# EAGLE design Nusbio 2-FT232BreakOut (EAGLE 7.5.0)
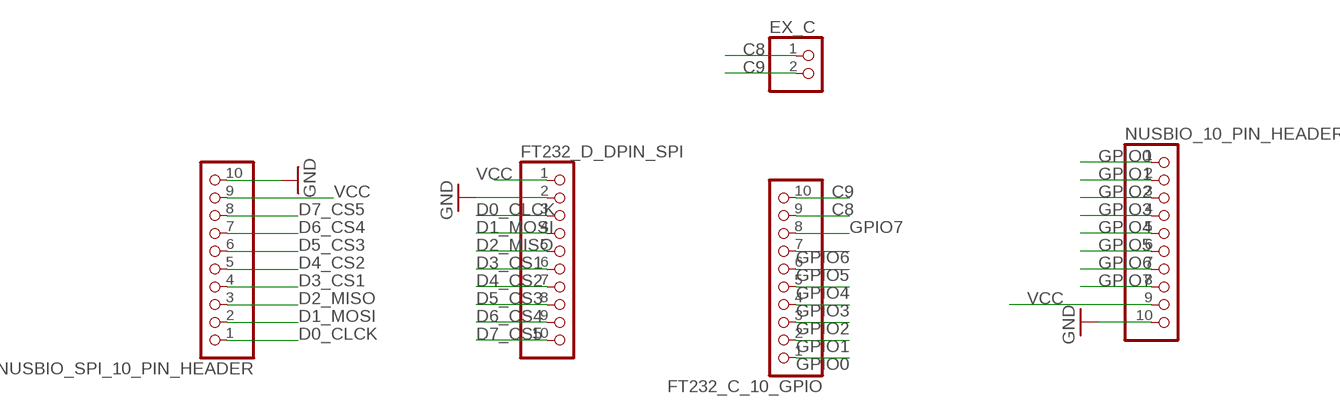
[diagram p0: schematic, sheet 1]

## Parts
EX_C  PINHD-1X2  [1X02]
FT232_C_10_GPIO  PINHD-1X10  [1X10]
FT232_D_DPIN_SPI  PINHD-1X10  [1X10]
NUSBIO_10_PIN_HEADER  PINHD-1X10  [1X10]
NUSBIO_SPI_10_PIN_HEADER  PINHD-1X10  [1X10]

## Nets
C8: EX_C.1 FT232_C_10_GPIO.9
C9: EX_C.2 FT232_C_10_GPIO.10
D0_CLCK: FT232_D_DPIN_SPI.3 NUSBIO_SPI_10_PIN_HEADER.1
D1_MOSI: FT232_D_DPIN_SPI.4 NUSBIO_SPI_10_PIN_HEADER.2
D2_MISO: FT232_D_DPIN_SPI.5 NUSBIO_SPI_10_PIN_HEADER.3
D3_CS1: FT232_D_DPIN_SPI.6 NUSBIO_SPI_10_PIN_HEADER.4
D4_CS2: FT232_D_DPIN_SPI.7 NUSBIO_SPI_10_PIN_HEADER.5
D5_CS3: FT232_D_DPIN_SPI.8 NUSBIO_SPI_10_PIN_HEADER.6
D6_CS4: FT232_D_DPIN_SPI.9 NUSBIO_SPI_10_PIN_HEADER.7
D7_CS5: FT232_D_DPIN_SPI.10 NUSBIO_SPI_10_PIN_HEADER.8
GND: FT232_D_DPIN_SPI.2 NUSBIO_10_PIN_HEADER.10 NUSBIO_SPI_10_PIN_HEADER.10
GPIO0: FT232_C_10_GPIO.1 NUSBIO_10_PIN_HEADER.1
GPIO1: FT232_C_10_GPIO.2 NUSBIO_10_PIN_HEADER.2
GPIO2: FT232_C_10_GPIO.3 NUSBIO_10_PIN_HEADER.3
GPIO3: FT232_C_10_GPIO.4 NUSBIO_10_PIN_HEADER.4
GPIO4: FT232_C_10_GPIO.5 NUSBIO_10_PIN_HEADER.5
GPIO5: FT232_C_10_GPIO.6 NUSBIO_10_PIN_HEADER.6
GPIO6: FT232_C_10_GPIO.7 NUSBIO_10_PIN_HEADER.7
GPIO7: FT232_C_10_GPIO.8 NUSBIO_10_PIN_HEADER.8
VCC: FT232_D_DPIN_SPI.1 NUSBIO_10_PIN_HEADER.9 NUSBIO_SPI_10_PIN_HEADER.9

## Library data of the parts
EX_C = pinhead:PINHD-1X2: PIN HEADER
FT232_C_10_GPIO FT232_D_DPIN_SPI NUSBIO_10_PIN_HEADER NUSBIO_SPI_10_PIN_HEADER = pinhead:PINHD-1X10: PIN HEADER

## Board
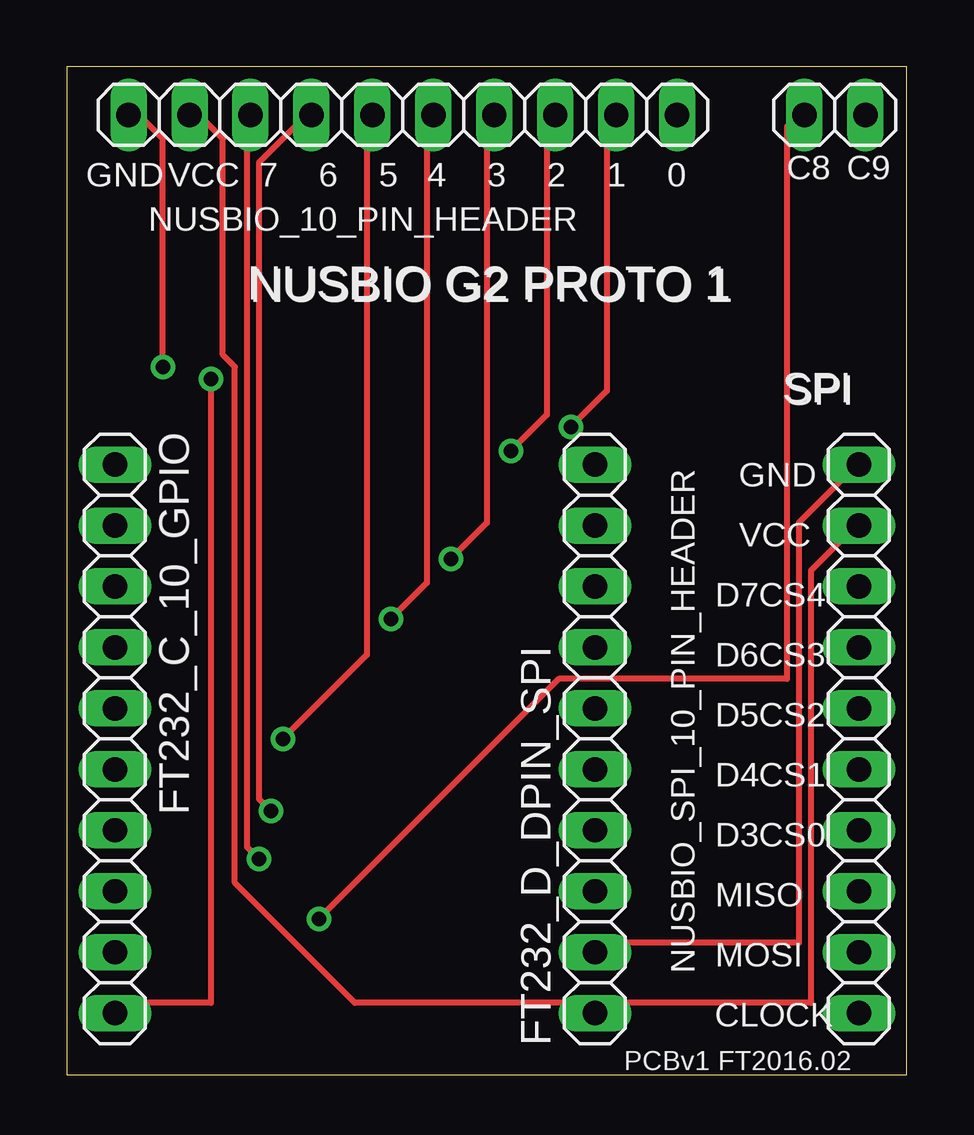
[diagram p1: board, top side]
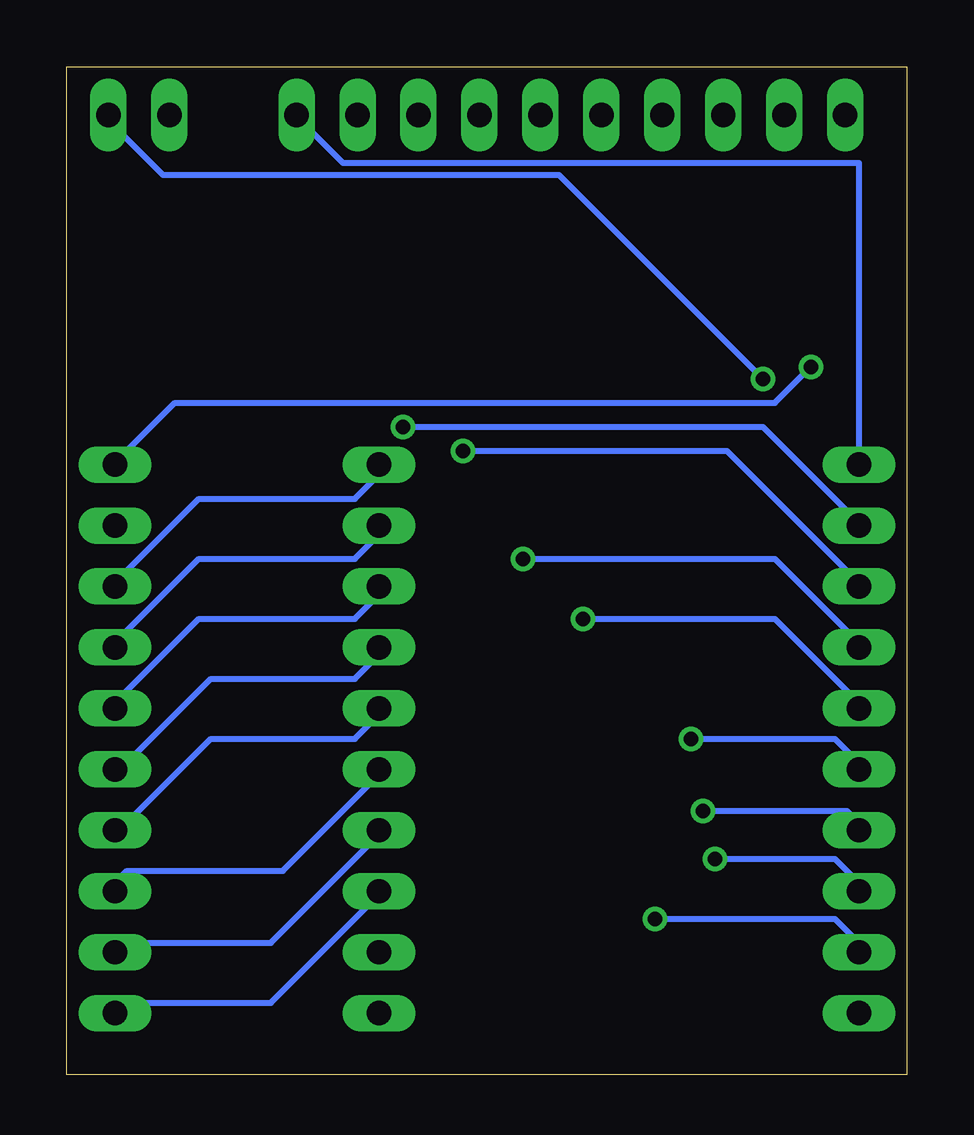
[diagram p2: board, bottom side, seen from below]

Size 35 x 42 mm. Coordinates in mm from the lower left corner, seen from the top.
Outline: 0,0 35,0 35,42 0,42 0,0
Copper layers (1*16): Top 0.035mm / dielectric 1.5mm / Bottom 0.035mm
Design rules "default": minimum track width 10mil, minimum drill 24mil, track to track 8mil, track to pad 8mil, pad to pad 8mil, via to via 8mil, smd to smd 8mil, copper to edge 40mil, drill to drill 8mil, minimum pad ring 10mil, minimum via ring 8mil, stop-mask expansion 4mil, vias tented up to drill 0mil, thermal gap 10mil

### Footprints (pad centres in the part's own frame; a part is rotated, then mirrored left to right if it is on the bottom)
1X02 = drill 1.016 long: 1 -1.27,0; 2 1.27,0
1X10 = drill 1.016 long: 1 -11.43,0; 2 -8.89,0; 3 -6.35,0; 4 -3.81,0; 5 -1.27,0; 6 1.27,0; 7 3.81,0; 8 6.35,0; 9 8.89,0; 10 11.43,0

### Placement (x,y rotation side)
EX_C  32,40 0 top
FT232_C_10_GPIO  2,14 270 top
FT232_D_DPIN_SPI  22,14 90 top
NUSBIO_10_PIN_HEADER  14,40 180 top
NUSBIO_SPI_10_PIN_HEADER  33,14 90 top

### Tracks (layer width: path | path; a pad name or v marks a point on that pad's centre or on a via)
C8  (via drill 0.61)
  Top 0.254: v10.5,6.5 20.5,16.5 30,16.5 30,39.5 30.5,40 EX_C.1
  Bottom 0.254: v10.5,6.5 3,6.5 2,5.5 FT232_C_10_GPIO.9
C9  (via drill 0.61)
  Top 0.254: v6,29 6,3 2,3 FT232_C_10_GPIO.10
  Bottom 0.254: v6,29 14.5,37.5 31,37.5 33.5,40 EX_C.2
D0_CLCK
  Bottom 0.254: FT232_D_DPIN_SPI.3 22,7.5 26.5,3 33,3 NUSBIO_SPI_10_PIN_HEADER.1
D1_MOSI
  Bottom 0.254: FT232_D_DPIN_SPI.4 22,10 26.5,5.5 33,5.5 NUSBIO_SPI_10_PIN_HEADER.2
D2_MISO
  Bottom 0.254: FT232_D_DPIN_SPI.5 22,12.5 26,8.5 32.5,8.5 33,8 NUSBIO_SPI_10_PIN_HEADER.3
D3_CS1
  Bottom 0.254: FT232_D_DPIN_SPI.6 22,15 23,14 29,14 32.5,10.5 33,10.5 NUSBIO_SPI_10_PIN_HEADER.4
D4_CS2
  Bottom 0.254: FT232_D_DPIN_SPI.7 22,17.5 23,16.5 29,16.5 32.5,13 33,13 NUSBIO_SPI_10_PIN_HEADER.5
D5_CS3
  Bottom 0.254: FT232_D_DPIN_SPI.8 22,20 23,19 29.5,19 33,15.5 NUSBIO_SPI_10_PIN_HEADER.6
D6_CS4
  Bottom 0.254: FT232_D_DPIN_SPI.9 22,22.5 23,21.5 29.5,21.5 33,18 NUSBIO_SPI_10_PIN_HEADER.7
D7_CS5
  Bottom 0.254: FT232_D_DPIN_SPI.10 22,25 23,24 29.5,24 33,20.5 NUSBIO_SPI_10_PIN_HEADER.8
GND  (via drill 0.61)
  Top 0.254: FT232_D_DPIN_SPI.2 22,5.5 30.5,5.5 30.5,23 33,25.5 NUSBIO_SPI_10_PIN_HEADER.10 | v4,29.5 4,39 3,40 NUSBIO_10_PIN_HEADER.10
  Bottom 0.254: v4,29.5 5.5,28 30.5,28 33,25.5 NUSBIO_SPI_10_PIN_HEADER.10
GPIO0
  Bottom 0.254: FT232_C_10_GPIO.1 2,38 23.5,38 25.5,40 NUSBIO_10_PIN_HEADER.1
GPIO1  (via drill 0.61)
  Top 0.254: v21,27 22.5,28.5 22.5,40 NUSBIO_10_PIN_HEADER.2
  Bottom 0.254: v21,27 6,27 2,23 FT232_C_10_GPIO.2
GPIO2  (via drill 0.61)
  Top 0.254: v18.5,26 20,27.5 20,40 NUSBIO_10_PIN_HEADER.3
  Bottom 0.254: v18.5,26 7.5,26 2,20.5 FT232_C_10_GPIO.3
GPIO3  (via drill 0.61)
  Top 0.254: v16,21.5 17.5,23 17.5,40 NUSBIO_10_PIN_HEADER.4
  Bottom 0.254: v16,21.5 5.5,21.5 2,18 FT232_C_10_GPIO.4
GPIO4  (via drill 0.61)
  Top 0.254: v13.5,19 15,20.5 15,40 NUSBIO_10_PIN_HEADER.5
  Bottom 0.254: v13.5,19 5.5,19 2,15.5 FT232_C_10_GPIO.5
GPIO5  (via drill 0.61)
  Top 0.254: v9,14 12.5,17.5 12.5,40 NUSBIO_10_PIN_HEADER.6
  Bottom 0.254: v9,14 3,14 2,13 FT232_C_10_GPIO.6
GPIO6  (via drill 0.61)
  Top 0.254: v8.5,11 8,11.5 8,38 10,40 NUSBIO_10_PIN_HEADER.7
  Bottom 0.254: v8.5,11 2.5,11 2,10.5 FT232_C_10_GPIO.7
GPIO7  (via drill 0.61)
  Top 0.254: v8,9 7.5,9.5 7.5,40 NUSBIO_10_PIN_HEADER.8
  Bottom 0.254: v8,9 3,9 2,8 FT232_C_10_GPIO.8
VCC
  Top 0.254: 22,3 31,3 31,21 33,23 NUSBIO_SPI_10_PIN_HEADER.9 | 22,3 12,3 7,8 7,29.5 6.5,30 6.5,39 5.5,40 NUSBIO_10_PIN_HEADER.9 | 22,3 FT232_D_DPIN_SPI.1

### Text on the board
tNames: GND | VCC | 7 | 6 | 5 | 4 | 3 | 2 | 1 | 0 | C8 | C9 | NUSBIO G2 PROTO 1 | NUSBIO G2 PROTO 1 | SPI | SPI | GND | VCC | D7CS4 | D6CS3 | D5CS2 | D4CS1 | D3CS0 | MISO | MOSI | CLOCK | PCBv1 FT2016.02